# Altium project PCB DESIGN 1.PrjPcb
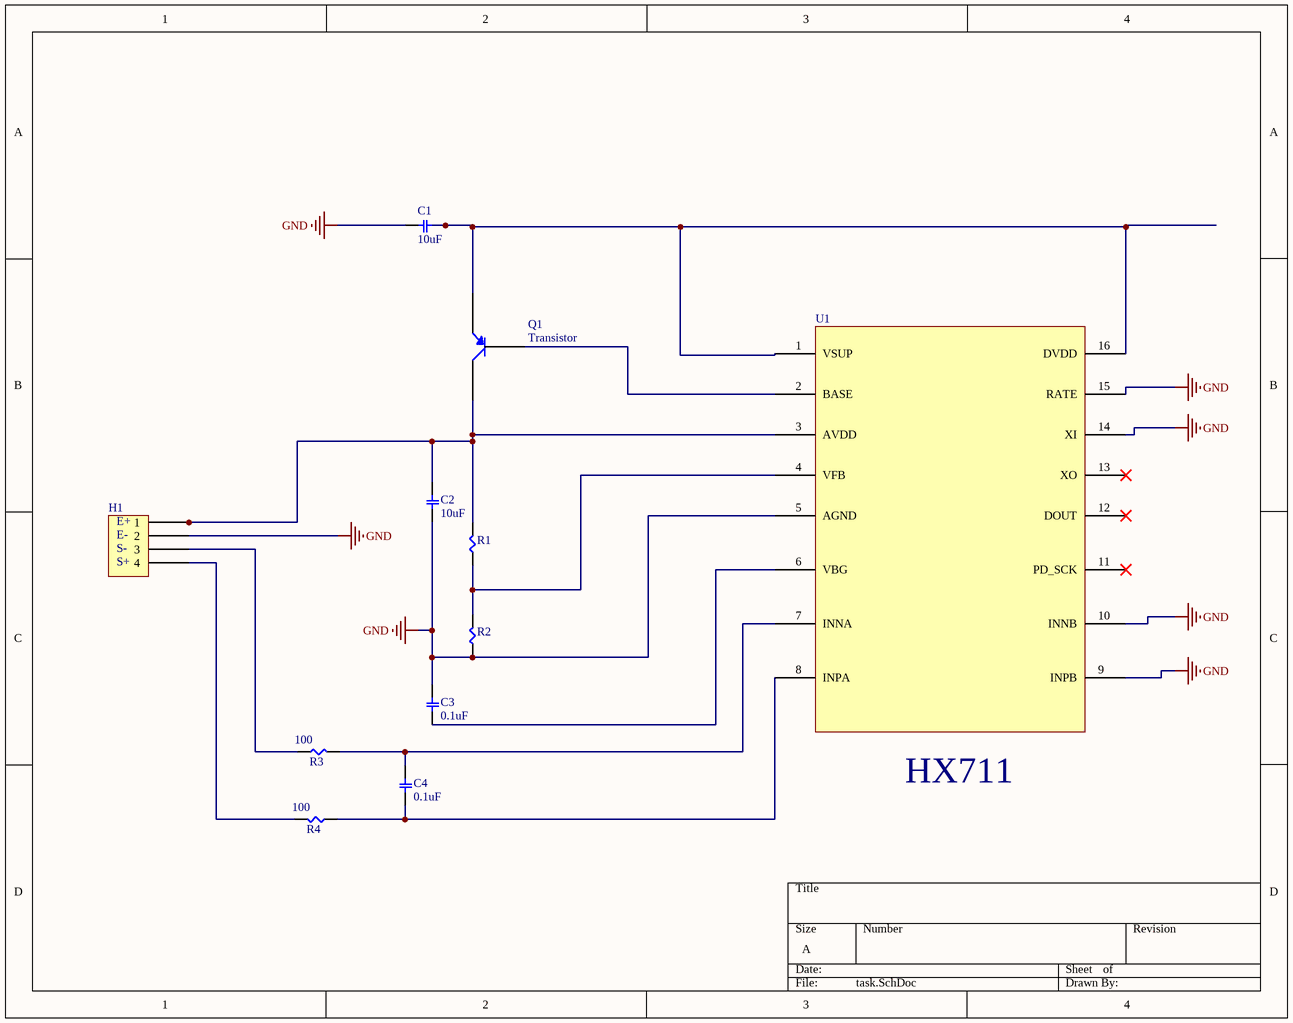
[diagram p0: task.SchDoc]
1 sheet, 11 parts. Net scope: global (net labels, ports and power ports of the same name join across sheets).
Board file: task.PcbDoc

## Sheet task.SchDoc
size A; SheetNumber: 1; SheetTotal: 1

### Parts
C1  10uF  [Capacitor - duplicate]
C2  10uF  [Capacitor - duplicate]
C3  0.1uF  [Capacitor - duplicate]
C4  0.1uF  [Capacitor - duplicate]
H1  Header  [Edge Connector]  (value not drawn)
Q1  Transistor  [Transistor]
R1  resistance  [Resistor]  (value not drawn)
R2  resistance  [Resistor]  (value not drawn)
R3  100  [Resistor]
R4  100  [Resistor]
U1  hx711  [SOP16]  (value not drawn)

### Nets
GND: C1.1 C2.1 C3.2 H1.2 R2.1 U1.5(AGND) U1.9(INPB) U1.10(INNB) U1.14(XI) U1.15(RATE)
NetC1_2: C1.2 Q1.G U1.1(VSUP) U1.16(DVDD)
NetC2_2: C2.2 H1.1 Q1.S R1.2 U1.3(AVDD)
NetC3_1: C3.1 U1.6(VBG)
NetC4_1: C4.1 R4.1 U1.8(INPA)
NetC4_2: C4.2 R3.2 U1.7(INNA)
NetH1_3: H1.3 R3.1
NetH1_4: H1.4 R4.2
NetQ1_D: Q1.D U1.2(BASE)
NetR1_1: R1.1 R2.2 U1.4(VFB)

Not connected (* = marked no-connect by the designer): U1 11(PD_SCK)* 12(DOUT)* 13(XO)*

### Notes on the sheet
- HX711
- (in symbol Header) E+; E-; S-; S+

### Library data of the parts
C1-C4 = Capacitor
R3 R4 = resistance
U1 = hx711: Manufacturer: Avia Semicon (Xiamen); Manufacturer part: HX711; supplier part number: C6705483; supplier: lcsc
Q1 = Transistor: Parameter 1: *